# Altium schematic sheet core.SchDoc
size A2
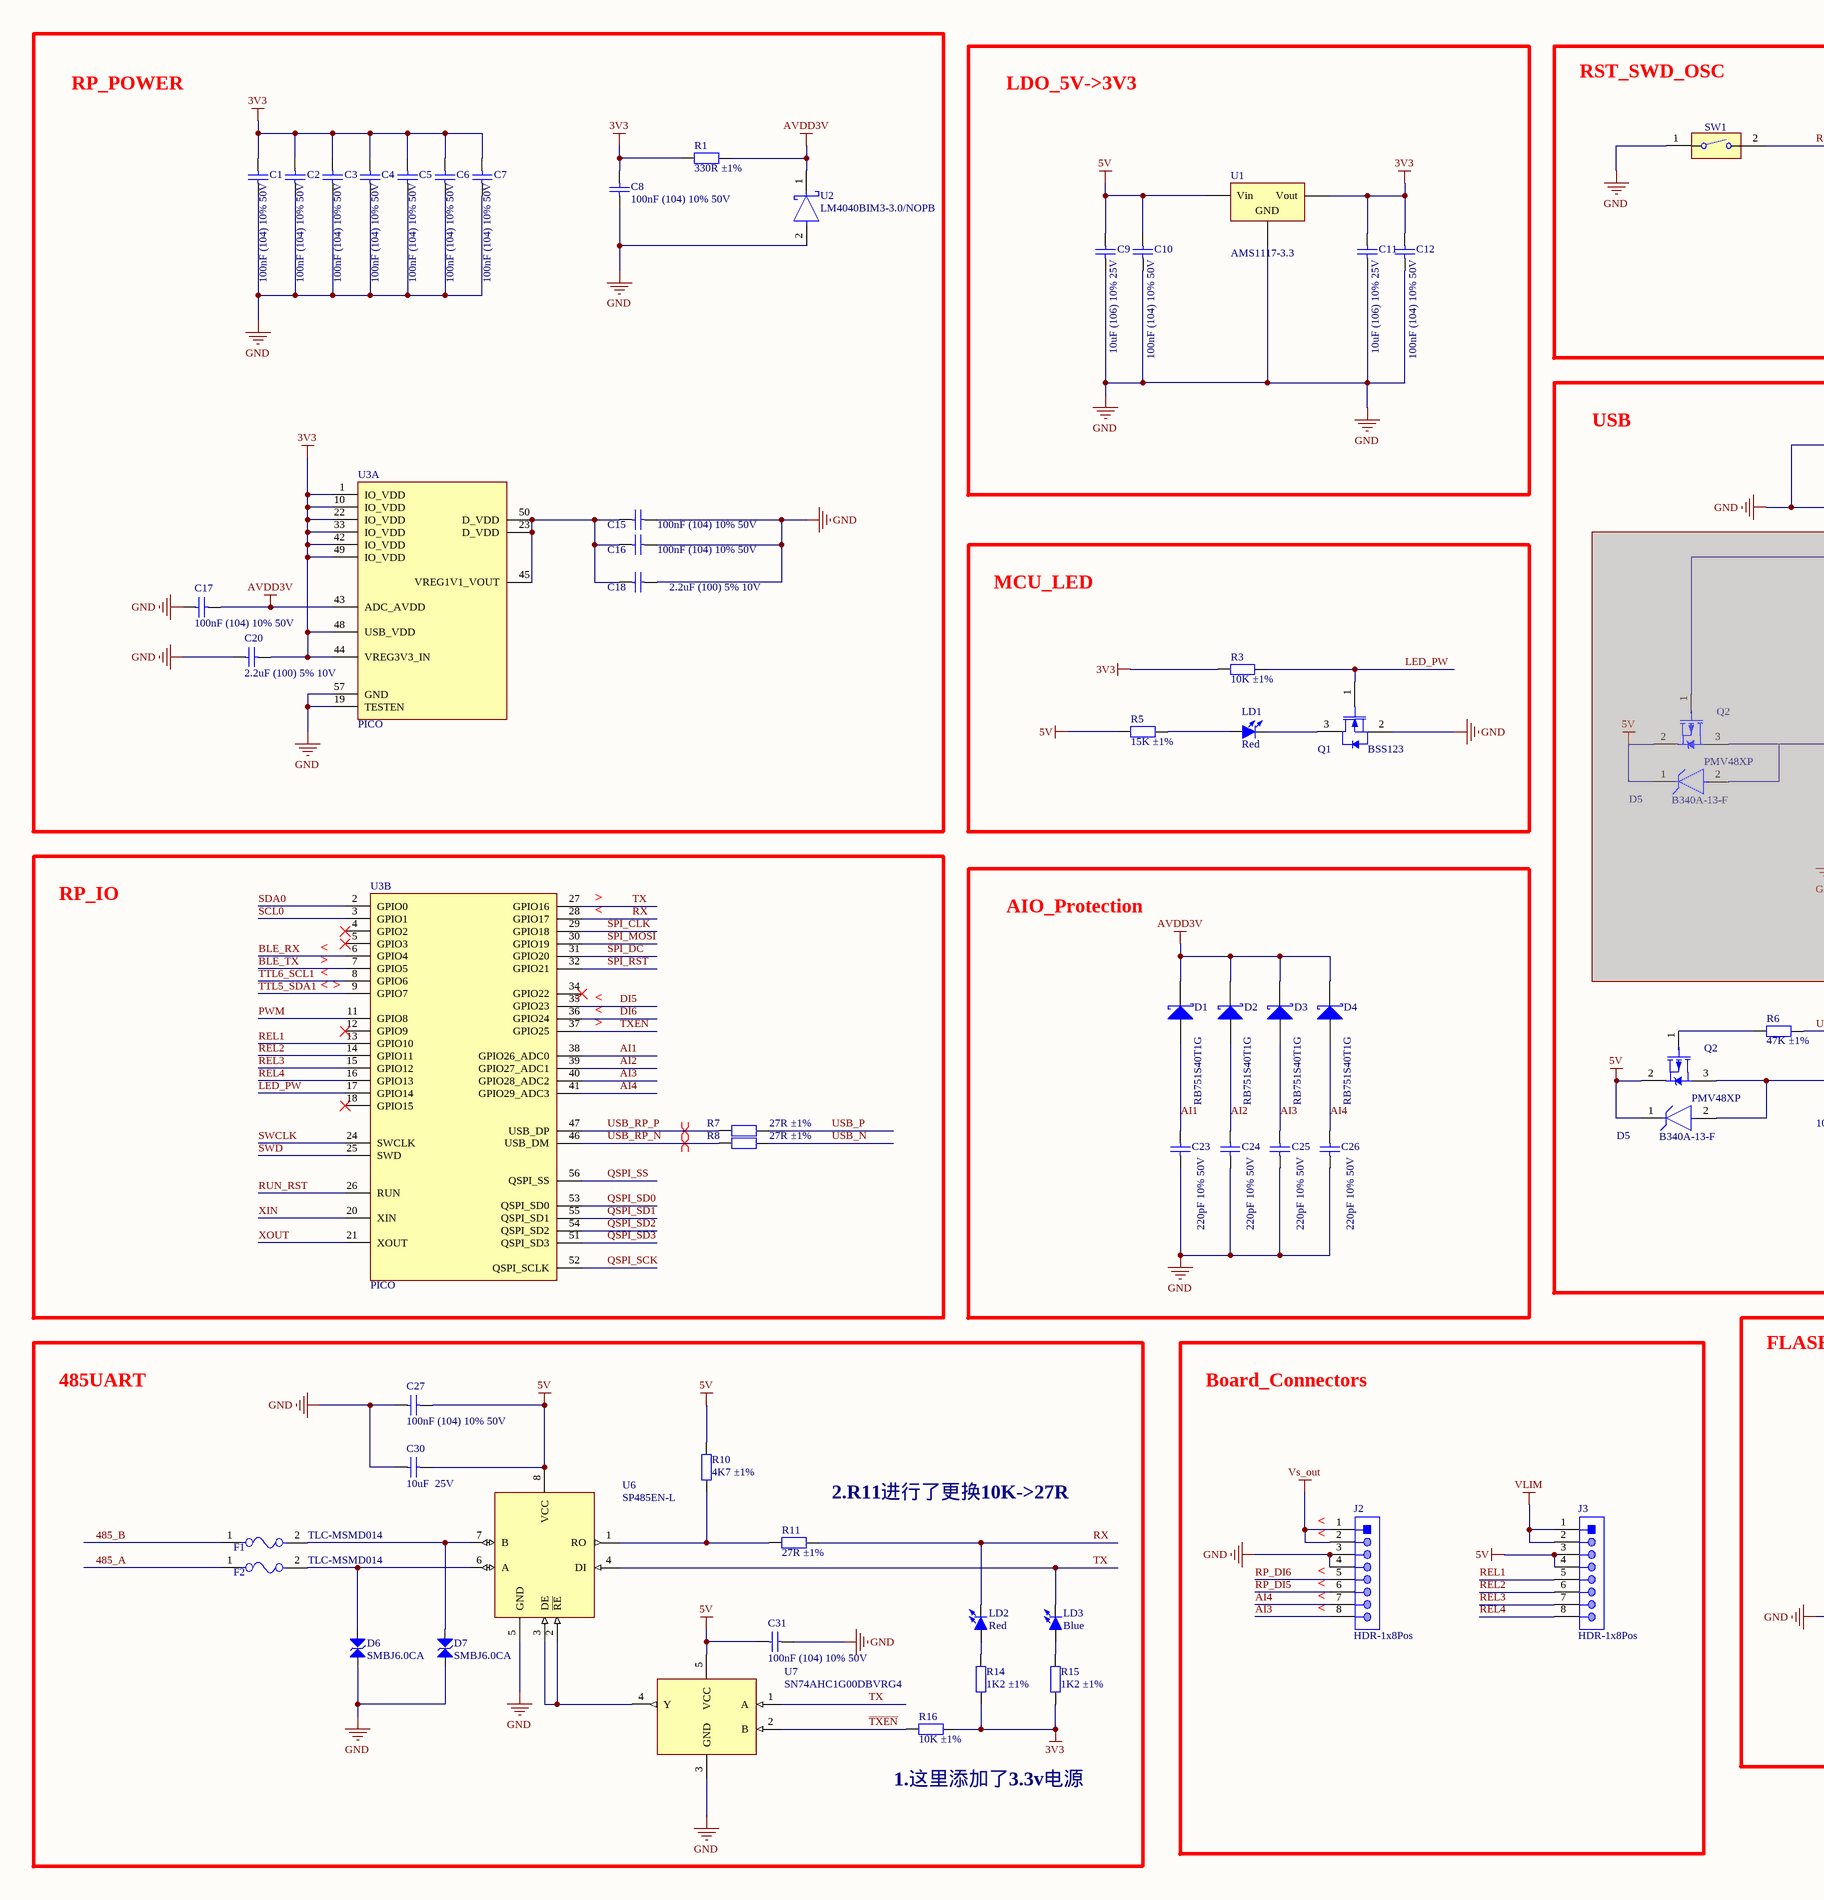
[diagram p0: core.SchDoc, left]
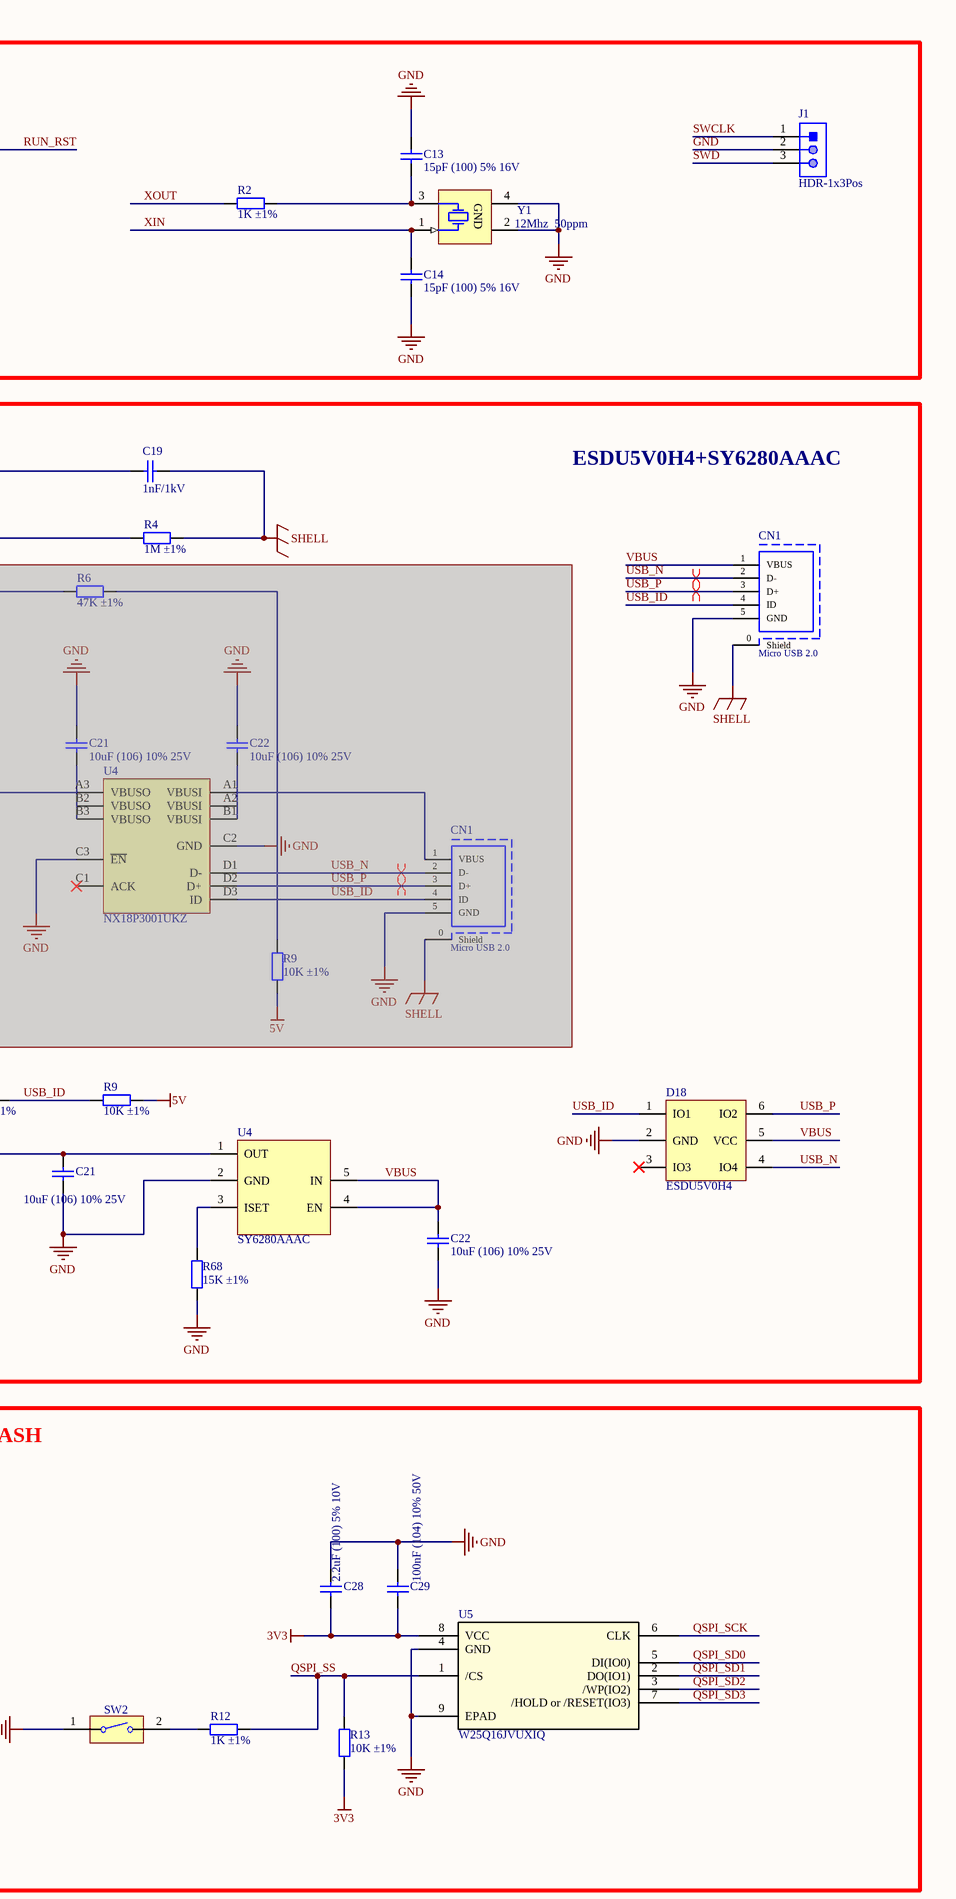
[diagram p1: core.SchDoc, right]

## Parts
(Parts that share a designator on the sheet are numbered #1, #2 ... from top to bottom, then left to right.)
C1  100nF (104) 10% 50V  [0402_C]
C2  100nF (104) 10% 50V  [0402_C]
C3  100nF (104) 10% 50V  [0402_C]
C4  100nF (104) 10% 50V  [0402_C]
C5  100nF (104) 10% 50V  [0402_C]
C6  100nF (104) 10% 50V  [0402_C]
C7  100nF (104) 10% 50V  [0402_C]
C8  100nF (104) 10% 50V  [0402_C]
C9  10uF (106) 10% 25V  [0603_C]
C10  100nF (104) 10% 50V  [0402_C]
C11  10uF (106) 10% 25V  [0603_C]
C12  100nF (104) 10% 50V  [0402_C]
C13  15pF (100) 5% 16V  [0402_C]
C14  15pF (100) 5% 16V  [0402_C]
C15  100nF (104) 10% 50V  [0402_C]
C16  100nF (104) 10% 50V  [0402_C]
C17  100nF (104) 10% 50V  [0402_C]
C18  2.2uF (100) 5% 10V  [0603_C]
C19  1nF/1kV  [0805_C]
C20  2.2uF (100) 5% 10V  [0603_C]
C21#1  10uF (106) 10% 25V  [0603_C]  (masked out: inside a compile mask, not in the netlist)
C21#2  10uF (106) 10% 25V  [0603_C]
C22#1  10uF (106) 10% 25V  [0603_C]  (masked out: inside a compile mask, not in the netlist)
C22#2  10uF (106) 10% 25V  [0603_C]
C23  220pF 10% 50V  [0402_C]
C24  220pF 10% 50V  [0402_C]
C25  220pF 10% 50V  [0402_C]
C26  220pF 10% 50V  [0402_C]
C27  100nF (104) 10% 50V  [0402_C]
C28  2.2uF (100) 5% 10V  [0603_C]
C29  100nF (104) 10% 50V  [0402_C]
C30  10uF  25V  [0603_C]
C31  100nF (104) 10% 50V  [0402_C]
CN1#1  Micro USB 2.0  [USB-MICRO-A]
CN1#2  Micro USB 2.0  [USB-MICRO-A]  (masked out: inside a compile mask, not in the netlist)
D1  RB751S40T1G  [SOD-523]
D2  RB751S40T1G  [SOD-523]
D3  RB751S40T1G  [SOD-523]
D4  RB751S40T1G  [SOD-523]
D5#1  B340A-13-F  [DO-214AC]  (masked out: inside a compile mask, not in the netlist)
D5#2  B340A-13-F  [DO-214AC]
D6  SMBJ6.0CA  [DO-214AA]
D7  SMBJ6.0CA  [DO-214AA]
D18  ESDU5V0H4  [SOT23-6]
F1  TLC-MSMD014  [1812_R]
F2  TLC-MSMD014  [1812_R]
J1  HDR-1x3Pos  [HDR-2.54-1x3-V]
J2  HDR-1x8Pos  [Pin Header 1x8 TH Pitch 2.54mm]
J3  HDR-1x8Pos  [Pin Header 1x8 TH Pitch 2.54mm]
LD1  Red  [0603_LED]
LD2  Red  [0603_LED]
LD3  Blue  [0603_LED]
Q1  BSS123  [SOT95P245X110-3N]
Q2#1  PMV48XP  [SOT-23-3]  (masked out: inside a compile mask, not in the netlist)
Q2#2  PMV48XP  [SOT-23-3]
R1  330R ±1%  [0402_R]
R2  1K ±1%  [0402_R]
R3  10K ±1%  [0402_R]
R4  1M ±1%  [0805_R]
R5  15K ±1%  [0402_R]
R6#1  47K ±1%  [0402_R]  (masked out: inside a compile mask, not in the netlist)
R6#2  47K ±1%  [0402_R]
R7  27R ±1%  [0402_R]
R8  27R ±1%  [0402_R]
R9#1  10K ±1%  [0402_R]  (masked out: inside a compile mask, not in the netlist)
R9#2  10K ±1%  [0402_R]
R10  4K7 ±1%  [0402_R]
R11  27R ±1%  [0402_R]
R12  1K ±1%  [0402_R]
R13  10K ±1%  [0402_R]
R14  1K2 ±1%  [0402_R]
R15  1K2 ±1%  [0402_R]
R16  10K ±1%  [0402_R]
R68  15K ±1%  [0402_R]
SW1  (no value)  [KEY-SMD_L6.1-W3.7-LS8.0]
SW2  (no value)  [KEY-SMD_L6.1-W3.7-LS8.0]
U1  AMS1117-3.3  [SOT-223]
U2  LM4040BIM3-3.0/NOPB  [SOT23]
U3  PICO  [RP2040]  (parts A,B of 2)
U4#1  NX18P3001UKZ  [WLCSP12]  (masked out: inside a compile mask, not in the netlist)
U4#2  SY6280AAAC  [SOT-23-5]
U5  W25Q16JVUXIQ  [W25Q16JVUXIQ_WIN]
U6  SP485EN-L  [SOIC8]
U7  SN74AHC1G00DBVRG4  [SOT-23-5]
Y1  12Mhz  50ppm  [OSC_SI-TIME_SIT1602-2]

## Blocks framed on the sheet
RP_POWER: C1-C8 C15-C18 C20 R1 U2 U3
LDO_5V->3V3: C9-C12 U1
RST_SWD_OSC: C13 C14 J1 R2 SW1 Y1
MCU_LED: LD1 Q1 R3 R5
RP_IO: R7 R8 U3
AIO_Protection: C23-C26 D1-D4
Board_Connectors: J2 J3
FLASH: C28 C29 R12 R13 SW2 U5

## Nets
3V3: C1.2 C2.2 C3.2 C4.2 C5.2 C6.2 C7.2 C8.2 C11.2 C12.2 C20.1 C28.2 C29.1 R1.1 R3.1 R13.1 R14.2 R15.2 R16.1 U1.2(Vout) U3.1(IO_VDD) U3.10(IO_VDD) U3.22(IO_VDD) U3.33(IO_VDD) U3.42(IO_VDD) U3.44(VREG3V3_IN) U3.48(USB_VDD) U3.49(IO_VDD) U5.8(VCC)
5V: C9.2 C10.2 C27.1 C30.2 C31.2 D5#2.1(C) J3.3 J3.4 Q2#2.2(S) R5.1 R9#2.1 R10.2 U1.3(Vin) U6.8(VCC) U7.5(VCC)
AVDD3V: C17.1 D1.1(K) D2.1(K) D3.1(K) D4.1(K) R1.2 U2.1 U3.43(ADC_AVDD)
GND: C1.1 C2.1 C3.1 C4.1 C5.1 C6.1 C7.1 C8.1 C9.1 C10.1 C11.1 C12.1 C13.2 C14.1 C15.2 C16.2 C17.2 C18.1 C19.1 C20.2 C21#2.1 C22#2.1 C23.1 C24.1 C25.1 C26.1 C27.2 C28.1 C29.2 C30.1 C31.1 CN1#1.5(GND) D6.2 D7.2 D18.2(GND) J1.2 J2.3 J2.4 Q1.2(SOURCE) R4.2 R68.1 SW1.1 SW2.1 U1.1(GND) U2.2 U3.19(TESTEN) U3.57(GND) U4#2.2(GND) U5.4(GND) U5.9(EPAD) U6.5(GND) U7.3(GND) Y1.2(GND) Y1.4(GND)
SHELL: C19.2 CN1#1.0(Shield) R4.1
VLIM: J3.1 J3.2
Vs_out: J2.1 J2.2
485_A: F2.1
485_B: F1.1
~{TXEN}: R16.2 U3.37(GPIO25) U7.2(B)
AI1: C23.2 D1.2(A) U3.38(GPIO26_ADC0)
AI2: C24.2 D2.2(A) U3.39(GPIO27_ADC1)
AI3: C25.2 D3.2(A) J2.8 U3.40(GPIO28_ADC2)
AI4: C26.2 D4.2(A) J2.7 U3.41(GPIO29_ADC3)
BLE_RX: U3.6(GPIO4)
BLE_TX: U3.7(GPIO5)
DI5: U3.35(GPIO23)
DI6: U3.36(GPIO24)
LED_PW: Q1.1(GATE) R3.2 U3.17(GPIO14)
PWM: U3.11(GPIO8)
QSPI_SCK: U3.52(QSPI_SCLK) U5.6(CLK)
QSPI_SD0: U3.53(QSPI_SD0) U5.5(DI(IO0))
QSPI_SD1: U3.55(QSPI_SD1) U5.2(DO(IO1))
QSPI_SD2: U3.54(QSPI_SD2) U5.3(/WP(IO2))
QSPI_SD3: U3.51(QSPI_SD3) U5.7(/HOLD_or_/RESET(IO3))
QSPI_SS: R12.1 R13.2 U3.56(QSPI_SS) U5.1(/CS)
REL1: J3.5 U3.13(GPIO10)
REL2: J3.6 U3.14(GPIO11)
REL3: J3.7 U3.15(GPIO12)
REL4: J3.8 U3.16(GPIO13)
RP_DI5: J2.6
RP_DI6: J2.5
RUN_RST: SW1.2 U3.26(RUN)
RX: LD2.2(K) R11.1 U3.28(GPIO17)
SCL0: U3.3(GPIO1)
SDA0: U3.2(GPIO0)
SPI_CLK: U3.29(GPIO18)
SPI_DC: U3.31(GPIO20)
SPI_MOSI: U3.30(GPIO19)
SPI_RST: U3.32(GPIO21)
SWCLK: J1.1 U3.24(SWCLK)
SWD: J1.3 U3.25(SWD)
TTL5_SDA1: U3.9(GPIO7)
TTL6_SCL1: U3.8(GPIO6)
TX: LD3.2(K) U3.27(GPIO16) U6.4(DI) U7.1(A)
USB_ID: CN1#1.4(ID) D18.1(IO1) R6#2.1 R9#2.2
USB_N: CN1#1.2(D-) D18.4(IO4) R8.2
USB_P: CN1#1.3(D+) D18.6(IO2) R7.2
USB_RP_N: R8.1 U3.46(USB_DM)
USB_RP_P: R7.1 U3.47(USB_DP)
VBUS: C22#2.2 CN1#1.1(VBUS) D18.5(VCC) U4#2.4(EN) U4#2.5(IN)
XIN: C14.2 U3.20(XIN) Y1.1(X)
XOUT: R2.1 U3.21(XOUT)
NetC13_1: C13.1 R2.2 Y1.3(X)
NetC15_1: C15.1 C16.1 C18.2 U3.23(D_VDD) U3.45(VREG1V1_VOUT) U3.50(D_VDD)
NetC21#2_2: C21#2.2 D5#2.2(A) Q2#2.3(D) U4#2.1(OUT)
NetD6_1: D6.1 F2.2 U6.6(A)
NetD7_1: D7.1 F1.2 U6.7(B)
NetLD1_1: LD1.1(A) R5.2
NetLD1_2: LD1.2(K) Q1.3(DRAIN)
NetLD2_1: LD2.1(A) R14.1
NetLD3_1: LD3.1(A) R15.1
NetQ2#2_1: Q2#2.1(G) R6#2.2
NetR10_1: R10.1 R11.2 U6.1(RO)
NetR12_2: R12.2 SW2.2
NetR68_2: R68.2 U4#2.3(ISET)
NetU6_2: U6.2(~{RE}) U6.3(DE) U7.4(Y)

Not connected (* = marked no-connect by the designer): D18 3(IO3)*; U3 4(GPIO2)* 5(GPIO3)* 12(GPIO9)* 18(GPIO15)* 34(GPIO22)*

## Layout directives
differential pair: (no net found under the mark), USB_N, USB_P, USB_RP_N, USB_RP_P

## Notes on the sheet
- USB
- ESDU5V0H4+SY6280AAAC
- (near U3) <
- (near U3) >
- 485UART
- (near R11) 2.R11进行了更换10K->27R
- (near J2) <
- (near R16) 1.这里添加了3.3v电源

## Library data of the parts
C1-C8 C10 C12 C15-C17 C27 C29 C31 = 0402 100nF (104) 10% 16V: 贴片电容; ComponentLink1Description: 供应商链接; ComponentLink1URL: http://www.szlcsc.com/product/details_1877.html; Package: 0402; Supplier: LC; SuppliersPartNumber: C1525
C9 C11 C21#1 C21#2 C22#1 C22#2 = 0603 10uF (106) 10% 10V: 贴片电容; ComponentLink1Description: 供应商链接; ComponentLink1URL: http://www.szlcsc.com/product/details_20411.html; Package: 0603; Supplier: LC; SuppliersPartNumber: C19702
C13 C14 = 0402 10pF (100) 5% 50V: 贴片电容; ComponentLink1Description: 供应商链接; ComponentLink1URL: http://www.szlcsc.com/product/details_33914.html; Package: 0402; Supplier: LC; SuppliersPartNumber: C32949
C18 C20 C28 C30 = 0603 10pF (100) 5% 50V: 贴片电容; ComponentLink1Description: 供应商链接; ComponentLink1URL: http://www.szlcsc.com/product/details_1986.html; Package: 0603; Supplier: LC; SuppliersPartNumber: C1634
C19 = 0603 1.5nF (152) 10% 50V: 贴片电容; ComponentLink1Description: 供应商链接; ComponentLink1URL: http://www.szlcsc.com/product/details_1947.html; Package: 0603; Supplier: LC; SuppliersPartNumber: C1595
C23-C26 = 0402 150pF (151) 10% 50V: 贴片电容; ComponentLink1Description: 供应商链接; ComponentLink1URL: http://www.szlcsc.com/product/details_1879.html; Package: 0402; Supplier: LC; SuppliersPartNumber: C1527
CN1#1 CN1#2 = Micro-USB2.0-2: Micro USB 2.0 Type AB Receptacle WR-COM, Horizontal, SMT; Part Number: 629105150921; Manufacturer: Wurth Elektronik; Rated Current: 1.8A; Contact Resistance: 30mOhm; Working Voltage: 30VAC; Publisher: WurthElektronik; Operating Temperature: -40to85degC; Gender: Receptacle; Packaging: TapeandReel; Connector Type: MicroUSB2.0TypeAB; Datasheet URL: https://katalog.we-online.de/em/datasheet/629105150921.pdf; Mounting Technology: SMT; Orientation: Horizontal; Package Reference: 629105150921; Manufacturer URL: http://www.we-online.de
D1-D4 = B230A-13-F: B230A-13-F,SCHOTTKY RECTIFIER; Manufacturer: Diodes; Element Configuration: Single; Max Repetitive Reverse Voltage (Vrrm): 30V; Forward Current: 2A; Peak Non-Repetitive Surge Current: 50A; Peak Reverse Current: 500uA; Forward Voltage: 500mV; Polarity: Standard; Capacitance: 200pF; Supplier 1: Digi-Key; Manufacturer Part Number: B230A-13-F; RoHS: Yes; Category: Rectifier Diodes; Stock 1: 36331; Pricing 1: 1=0.45000, 10=0.33900, 25=0.30560, 100=0.16110, 250=0.15944, 500=0.14276, 1000=0.11110, 2500=0.10166 (USD); Mount: Surface Mount; Case/Package: SMA; Number of Pins: 2; Weight: 0.002258oz; Contact Plating: Tin,Matte; Min Operating Temperature: -65°C; Max Operating Temperature: 150°C; Packaging: Tape and Reel; Current Rating: 2A; Max Forward Surge Current (Ifsm): 50A; Max Reverse Voltage (DC): 30V; Average Rectified Current: 2A; Output Current: 2A; Package Quantity: 5000; Termination: SMD/SMT; Voltage Rating (DC): 30V; Length: 4.6mm; Height: 2.1mm; Width: 2.92mm; Radiation Hardening: No; Lead Free: Lead Free; REACH SVHC: No SVHC; ComponentLink1URL: https://datasheet.ciiva.com/27052/1538769-27052351.pdf?src-supplier=Jameco; ComponentLink1Description: https://datasheet.ciiva.com/27052/1538769-27052351.pdf?src-supplier=Jameco; ComponentLink2URL: https://datasheet.ciiva.com/16289/ds13004-16289654.pdf?src-supplier=Future+Electronics; ComponentLink2Description: https://datasheet.ciiva.com/16289/ds13004-16289654.pdf?src-supplier=Future+Electronics; ComponentLink3URL: https://datasheet.ciiva.com/8301/ds13004-8301593.pdf?src-supplier=Avnet; ComponentLink3Description: https://datasheet.ciiva.com/8301/ds13004-8301593.pdf?src-supplier=Avnet; ComponentLink4URL: https://datasheet.ciiva.com/4715/ds13004-70120-4715546.pdf?src-supplier=Mouser; ComponentLink4Description: https://datasheet.ciiva.com/4715/ds13004-70120-4715546.pdf?src-supplier=Mouser; ComponentLink5URL: https://datasheet.ciiva.com/22695/1911814-22695786.pdf?src-supplier=Element14; ComponentLink5Description: https://datasheet.ciiva.com/22695/1911814-22695786.pdf?src-supplier=Element14; Supplier Part Number 1: B230A-FDICT-ND
D5#1 D5#2 = SMAJ16A: Transient Voltage Suppressor, 6.40 to 231 V, 16 V Stand-off Voltage, Uni-Directional, -55 to 155 degC, 2-pin DO-214AC, Pb-Free, Tape and Reel; PartNumber: SMAJ16A-E3/61; Manufacturer: Vishay Semiconductor; VBR Uni-Directional (V): 6.4 to 231; VWM (V): 16; ID (uA): 1; IFSM: 40 A; PPPM (W): 400, 300; Packing: Tape and Reel; Operating Junction and Storage Temperature Range: -55 to 150 degC; Mounting Technology: Surface Mount; DatasheetVersion: 12/8/2013; PackageReference: DO-214AC-2; PackageDescription: 2-Pin DO-214AC (SMA), Body 4.245 x 2.665 mm; ComponentLink1Description: Manufacturer URL; RoHS: TRUE; ComponentLink3URL: http://www.vishay.com/docs/88390/smaj50a.pdf; ComponentLink1URL: http://www.vishay.com/; ComponentLink3Description: Package Specification; ComponentLink2Description: Datasheet; ComponentLink2URL: http://www.vishay.com/docs/88390/smaj50a.pdf
D6 D7 = TBV05C: TVS,ESD二极管
D18 = ESDU5V0H4: USB ESD保护
F1 F2 = Fuse 2A 0805: 贴片保险，自恢复
J1 = HDR-1x3Pos: 2.54mm 排针
J2 J3 = HDR-1x8Pos: 2.54mm 排针
LD1-LD3 = LED: 贴片LED; 版权归属: 源创客; BOM名称: 贴片LED; 学习资源: www.ooocke.com
Q1 = 2N7002: Trans Mosfet N-ch 60V 0.115A 3-PIN SOT-23 T/r; Manufacturer: Infineon; Rds On Max: 3R; Continuous Drain Current (ID): 300mA; Input Capacitance: 13pF; Max Power Dissipation: 500mW; Element Configuration: Single; Drain to Source Resistance: 4R; Gate to Source Voltage (Vgs): 20V; Turn-Off Delay Time: 5.5ns; Turn-On Delay Time: 3ns; Supplier 1: Digi-Key; Manufacturer Part Number: 2N7002; RoHS: Yes; Category: MOSFETs; Stock 1: 36038; Pricing 1: 1=0.29000, 10=0.23500, 25=0.19720, 100=0.09640, 250=0.09484, 500=0.08038, 1000=0.05585 (USD); Case/Package: SOT-23; Number of Pins: 3; Min Operating Temperature: -55°C; Max Operating Temperature: 150°C; Packaging: Tape and Reel; Drain to Source Voltage (Vdss): 60V; Max Dual Supply Voltage: 60V; Length: 2.9mm; Height: 1mm; Width: 1.3mm; Halogen Free: Halogen Free; ComponentLink1URL: http://uk.rs-online.com/webdocs/1073/0900766b81073ec5.pdf?src-supplier=RSComponents; ComponentLink1Description: http://uk.rs-online.com/webdocs/1073/0900766b81073ec5.pdf?src-supplier=RSComponents; Supplier Part Number 1: 2N7002H6327XTSA2CT-ND
Q2#1 Q2#2 = PMV48XP: MOSFET P-CH -20 V -3.5 A
R1-R5 R6#1 R6#2 R7 R8 R9#1 R9#2 R12 R13 R68 = 0402 1.2KΩ (1201) 1%: 贴片电阻; ComponentLink1Description: 供应商链接; ComponentLink1URL: http://www.szlcsc.com/product/details_26605.html; Package: 0402; Supplier: LC; SuppliersPartNumber: C25862
R10 R11 R14-R16 = 0402 100KΩ (1003) 1%: 贴片电阻; ComponentLink1Description: 供应商链接; ComponentLink1URL: http://www.szlcsc.com/product/details_26484.html; Package: 0402; Supplier: LC; SuppliersPartNumber: C25741
SW1 SW2 = SW 1x SPST DIP Switch: 1 Ways SPST DIP Switch
U1 = AMS1117-3.3: 低压差线性稳压(LDO); ComponentLink1Description: 供应商链接; ComponentLink1URL: http://www.szlcsc.com/product/details_6652.html; Package: SOT-223; Supplier: LC; SuppliersPartNumber: C6186
U2 = LM4040BIM3-3.0/NOPB: 电压基准，输出类型：固定 输出电压：3V 输出电流：15mA 精度：±0.1% 温度系数：100ppm/℃ 最小阴极电流调节：67μA 工作温度：-40℃~+85℃@(TA)
U3 = RP2040: 树莓派RP2040单片机
U4#1 = NX18P3001UKZ: USB保护开关，ESD器件
U4#2 = SY6280AAAC: USB电子开关，电流保护
U5 = W25Q16JVUXIQ: NOR快闪spiFlash, 3V, 16M-bit, 4Kb Uniform Sector, DTR, USON-8; Mfr_Name: Winbond; Copyright: Copyright (C) 2022 Ultra Librarian. All rights reserved.; Manufacturer_Part_Number: W25Q16JVUXIQ; RefDes: RefDes; Type: DEV
U6 = SP485EN-L: Enhanced Low Power Half-Duplex RS-485 Transceivers; MF: {'manufacturer': u'MaxLinear, Inc.'}; Availability: Unavailable; Price: None; Package: None; Value: *; MP: SP485EN-L
U7 = SN74AHC1G00DBVRG4: 与非门; MF: {'manufacturer': u'Texas Instruments'}; Availability: Unavailable; Price: None; Package: None; Value: *; MP: SN74AHC1G00DBVRG4
Y1 = Quartz Crystal 1X 2GND 3X 4GND: 贴片晶振 Crystal 4 pins 1=XTAL Control 2=GND3=XTAL 4=GND